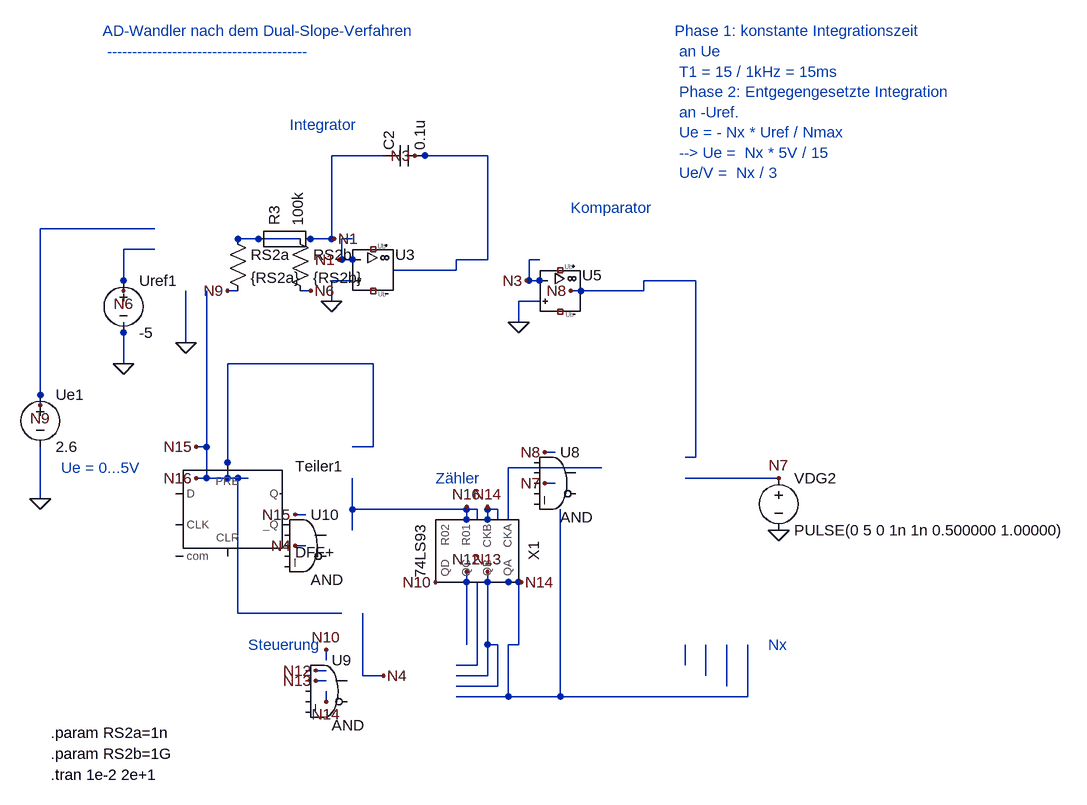
[diagram p0: schematic 8_2_3_Dual_Slope_ADC.asc]
8_2_3_Dual_Slope_ADC.asc, the LTspice schematic file:
Version 4
SHEET 1 880 680
WIRE 176 512 176 496
WIRE 528 400 512 400
WIRE 512 400 512 368
WIRE 512 368 528 368
WIRE 592 416 688 416
WIRE 688 416 688 400
WIRE 640 240 656 240
WIRE 816 432 800 432
WIRE 800 432 800 400
WIRE 800 400 816 400
WIRE 880 448 976 448
WIRE 976 448 976 432
WIRE 736 800 736 784
WIRE 736 784 752 784
WIRE 752 784 752 800
WIRE 704 800 704 784
WIRE 704 784 720 784
WIRE 720 784 720 800
WIRE 672 800 704 800
WIRE 768 896 784 896
WIRE 784 896 784 992
WIRE 784 992 768 992
WIRE 736 896 736 992
WIRE 736 992 752 992
WIRE 704 896 704 992
WIRE 720 896 720 992
WIRE 48 688 48 704
WIRE 352 368 448 368
WIRE 176 496 176 560
WIRE 496 368 464 368
WIRE 576 240 496 240
WIRE 496 240 496 368
WIRE 496 464 496 432
WIRE 496 432 528 432
WIRE 48 768 48 704
WIRE 656 240 736 240
WIRE 736 240 736 400
WIRE 352 368 384 368
WIRE 272 528 272 448
WIRE 528 688 560 688
WIRE 560 688 560 560
WIRE 560 560 336 560
WIRE 336 560 336 736
WIRE 336 736 352 736
WIRE 736 400 688 400
WIRE 816 464 784 464
WIRE 784 464 784 496
WIRE 1072 992 1072 1040
WIRE 1040 992 1040 1024
WIRE 176 432 176 384
WIRE 176 384 224 384
WIRE 48 608 48 352
WIRE 48 352 224 352
WIRE 304 448 304 736
WIRE 304 736 336 736
WIRE 352 736 368 736
WIRE 512 944 352 944
WIRE 352 944 352 736
WIRE 528 816 528 784
WIRE 528 784 528 736
WIRE 704 784 528 784
WIRE 1136 992 1136 1072
WIRE 1136 1072 848 1072
WIRE 768 992 768 1072
WIRE 1104 992 1104 1056
WIRE 848 1072 848 784
WIRE 720 1024 720 992
WIRE 688 1024 720 1024
WIRE 736 1040 736 992
WIRE 688 1040 736 1040
WIRE 752 1056 752 992
WIRE 688 1056 752 1056
WIRE 768 1072 848 1072
WIRE 688 1072 768 1072
WIRE 560 1040 544 1040
WIRE 544 1040 544 944
WIRE 912 720 768 720
WIRE 768 720 768 800
WIRE 1040 736 1184 736
WIRE 1040 704 1056 704
WIRE 1056 704 1056 432
WIRE 1056 432 976 432
WIRE 528 400 508 400
WIRE 464 368 500 368
WIRE 640 240 624 240
WIRE 816 432 796 432
WIRE 672 896 656 896
WIRE 488 1016 488 1000
WIRE 704 896 704 880
WIRE 488 1032 472 1032
WIRE 736 896 736 880
WIRE 488 1048 472 1048
WIRE 304 688 288 688
WIRE 456 792 440 792
WIRE 176 432 176 448
WIRE 448 448 464 448
WIRE 48 608 48 624
WIRE 352 448 336 448
WIRE 704 800 704 780
WIRE 304 736 288 736
WIRE 768 896 788 896
WIRE 736 800 736 780
WIRE 488 1064 488 1080
WIRE 560 1040 576 1040
WIRE 456 840 440 840
WIRE 840 744 824 744
WIRE 840 696 824 696
WIRE 880 448 864 448
FLAG 1184 816 0
FLAG 176 560 0
FLAG 496 464 0
FLAG 784 496 0
FLAG 48 768 0
FLAG 272 528 0
FLAG 176 560 0
FLAG 496 464 0
FLAG 784 496 0
FLAG 48 768 0
FLAG 272 528 0
FLAG 508 400 N1
FLAG 500 368 N1
FLAG 624 240 N3
FLAG 796 432 N3
FLAG 656 896 N10
FLAG 488 1000 N10
FLAG 704 880 N12
FLAG 472 1032 N12
FLAG 736 880 N13
FLAG 472 1048 N13
FLAG 288 688 N15
FLAG 440 792 N15
FLAG 176 448 N6
FLAG 464 448 N6
FLAG 48 624 N9
FLAG 336 448 N9
FLAG 704 780 N16
FLAG 288 736 N16
FLAG 788 896 N14
FLAG 736 780 N14
FLAG 488 1080 N14
FLAG 576 1040 N4
FLAG 440 840 N4
FLAG 824 744 N7
FLAG 1184 736 N7
FLAG 824 696 N8
FLAG 864 448 N8
SYMBOL voltage 176 416 R0
SYMATTR InstName Uref1
SYMATTR Value -5
SYMBOL UniversalOpAmp2 560 416 R0
SYMATTR InstName U3
SYMATTR Value UniversalOpAmp2
SYMBOL cap 576 256 R270
SYMATTR InstName C2
SYMATTR Value 0.1u
SYMBOL Misc\EuropeanResistor 368 384 R270
SYMATTR InstName R3
SYMATTR Value 100k
SYMBOL UniversalOpAmp2 848 448 R0
SYMATTR InstName U5
SYMATTR Value UniversalOpAmp2
SYMBOL 74LS93 720 848 R90
SYMATTR InstName X1
SYMATTR Prefix X
SYMATTR SpiceModel 74LS93
SYMBOL Digital\and 840 680 R0
SYMATTR InstName U8
SYMATTR Value AND
SYMATTR LibreSpice gate=and;inputs=2;vth=2.5;vhigh=5;pins=In1,In2,Out
SYMBOL voltage 1184 720 R0
SYMATTR InstName VDG2
SYMATTR Value PULSE(0 5 0 1n 1n 0.500000 1.00000)
SYMBOL voltage 48 592 R0
SYMATTR InstName Ue1
SYMATTR Value 2.6
SYMBOL res 336 352 R0
SYMATTR InstName RS2a
SYMATTR Value {RS2a}
SYMBOL res 432 352 R0
SYMATTR InstName RS2b
SYMATTR Value {RS2b}
SYMBOL Digital\and 488 1000 R0
SYMATTR InstName U9
SYMATTR Value AND
SYMATTR LibreSpice gate=and;inputs=4;vth=2.5;vhigh=5;pins=In1,In2,In3,In4,Out
SYMBOL Digital\dflop 336 712 R0
SYMATTR InstName Teiler1
SYMATTR Value DFF+
SYMATTR LibreSpice kind=dff;edge=rising;async=high;vth=2.5;vhigh=5;pins=D,CLK,SET,RESET,Q,~Q
SYMBOL Digital\and 456 776 R0
SYMATTR InstName U10
SYMATTR Value AND
SYMATTR LibreSpice gate=and;inputs=2;vth=2.5;vhigh=5;pins=In1,In2,Out
TEXT 64 1128 Left 2 !.param RS2a=1n
TEXT 64 1160 Left 2 !.param RS2b=1G
TEXT 64 1192 Left 2 !.tran 1e-2 2e+1
TEXT 80 720 Left 2 ;Ue = 0...5V
TEXT 144 48 Left 2 ;AD-Wandler nach dem Dual-Slope-Verfahren \n ----------------------------------------
TEXT 1024 48 Left 2 ;Phase 1: konstante Integrationszeit \n an Ue \n T1 = 15 / 1kHz = 15ms \n Phase 2: Entgegengesetzte Integration \n an -Uref. \n Ue = - Nx * Uref / Nmax \n --> Ue =  Nx * 5V / 15 \n Ue/V =  Nx / 3
TEXT 1168 992 Left 2 ;Nx
TEXT 656 736 Left 2 ;Zähler
TEXT 432 192 Left 2 ;Integrator
TEXT 864 320 Left 2 ;Komparator
TEXT 368 992 Left 2 ;Steuerung

The netlist it stands for:
* 8_2_3_Dual_Slope_ADC.asc
V§Uref1 N6 0 -5
XU3 0 N1 NC_01 NC_02 N3 level2 UniversalOpAmp2 Avol=1Meg GBW=10Meg Slew=10Meg Ilimit=25m Rail=0 Vos=0 En=0 Enk=0 In=0 Ink=0 Rin=500Meg  ; pins In+ In- V+ V- OUT
C2 N1 N3 0.1u
R3 N002 N1 100k
XU5 0 N3 NC_03 NC_04 N8 level2 UniversalOpAmp2 Avol=1Meg GBW=10Meg Slew=10Meg Ilimit=25m Rail=0 Vos=0 En=0 Enk=0 In=0 Ink=0 Rin=500Meg  ; pins In+ In- V+ V- OUT
XX1 N006 N14 N16 N16 N14 N13 N12 N10 74LS93 74LS93  ; pins CKA CKB R01 R02 QA QB QC QD
A§U8 0 0 0 0 0 0 0 0 AND AND
VDG2 N7 0 PULSE(0 5 0 1n 1n 0.500000 1.00000)
V§Ue1 N9 0 2.6
RS2a N002 N9 {RS2a}
RS2b N002 N6 {RS2b}
A§U9 0 0 0 0 0 0 0 0 AND AND
A§Teiler1 0 0 0 N16 0 0 0 0 DFLOP DFF+
A§U10 0 0 0 0 0 0 0 0 AND AND
.param RS2a=1n
.param RS2b=1G
.tran 1e-2 2e+1
* Ue = 0...5V
* AD-Wandler nach dem Dual-Slope-Verfahren
*  ----------------------------------------
* Phase 1: konstante Integrationszeit
*  an Ue
*  T1 = 15 / 1kHz = 15ms
*  Phase 2: Entgegengesetzte Integration
*  an -Uref.
*  Ue = - Nx * Uref / Nmax
*  --> Ue =  Nx * 5V / 15
*  Ue/V =  Nx / 3
* Nx
* Zähler
* Integrator
* Komparator
* Steuerung
.lib UniversalOpAmp2.lib
.backanno
.end